# EAGLE schematic Schematic (EAGLE 9.5.1)
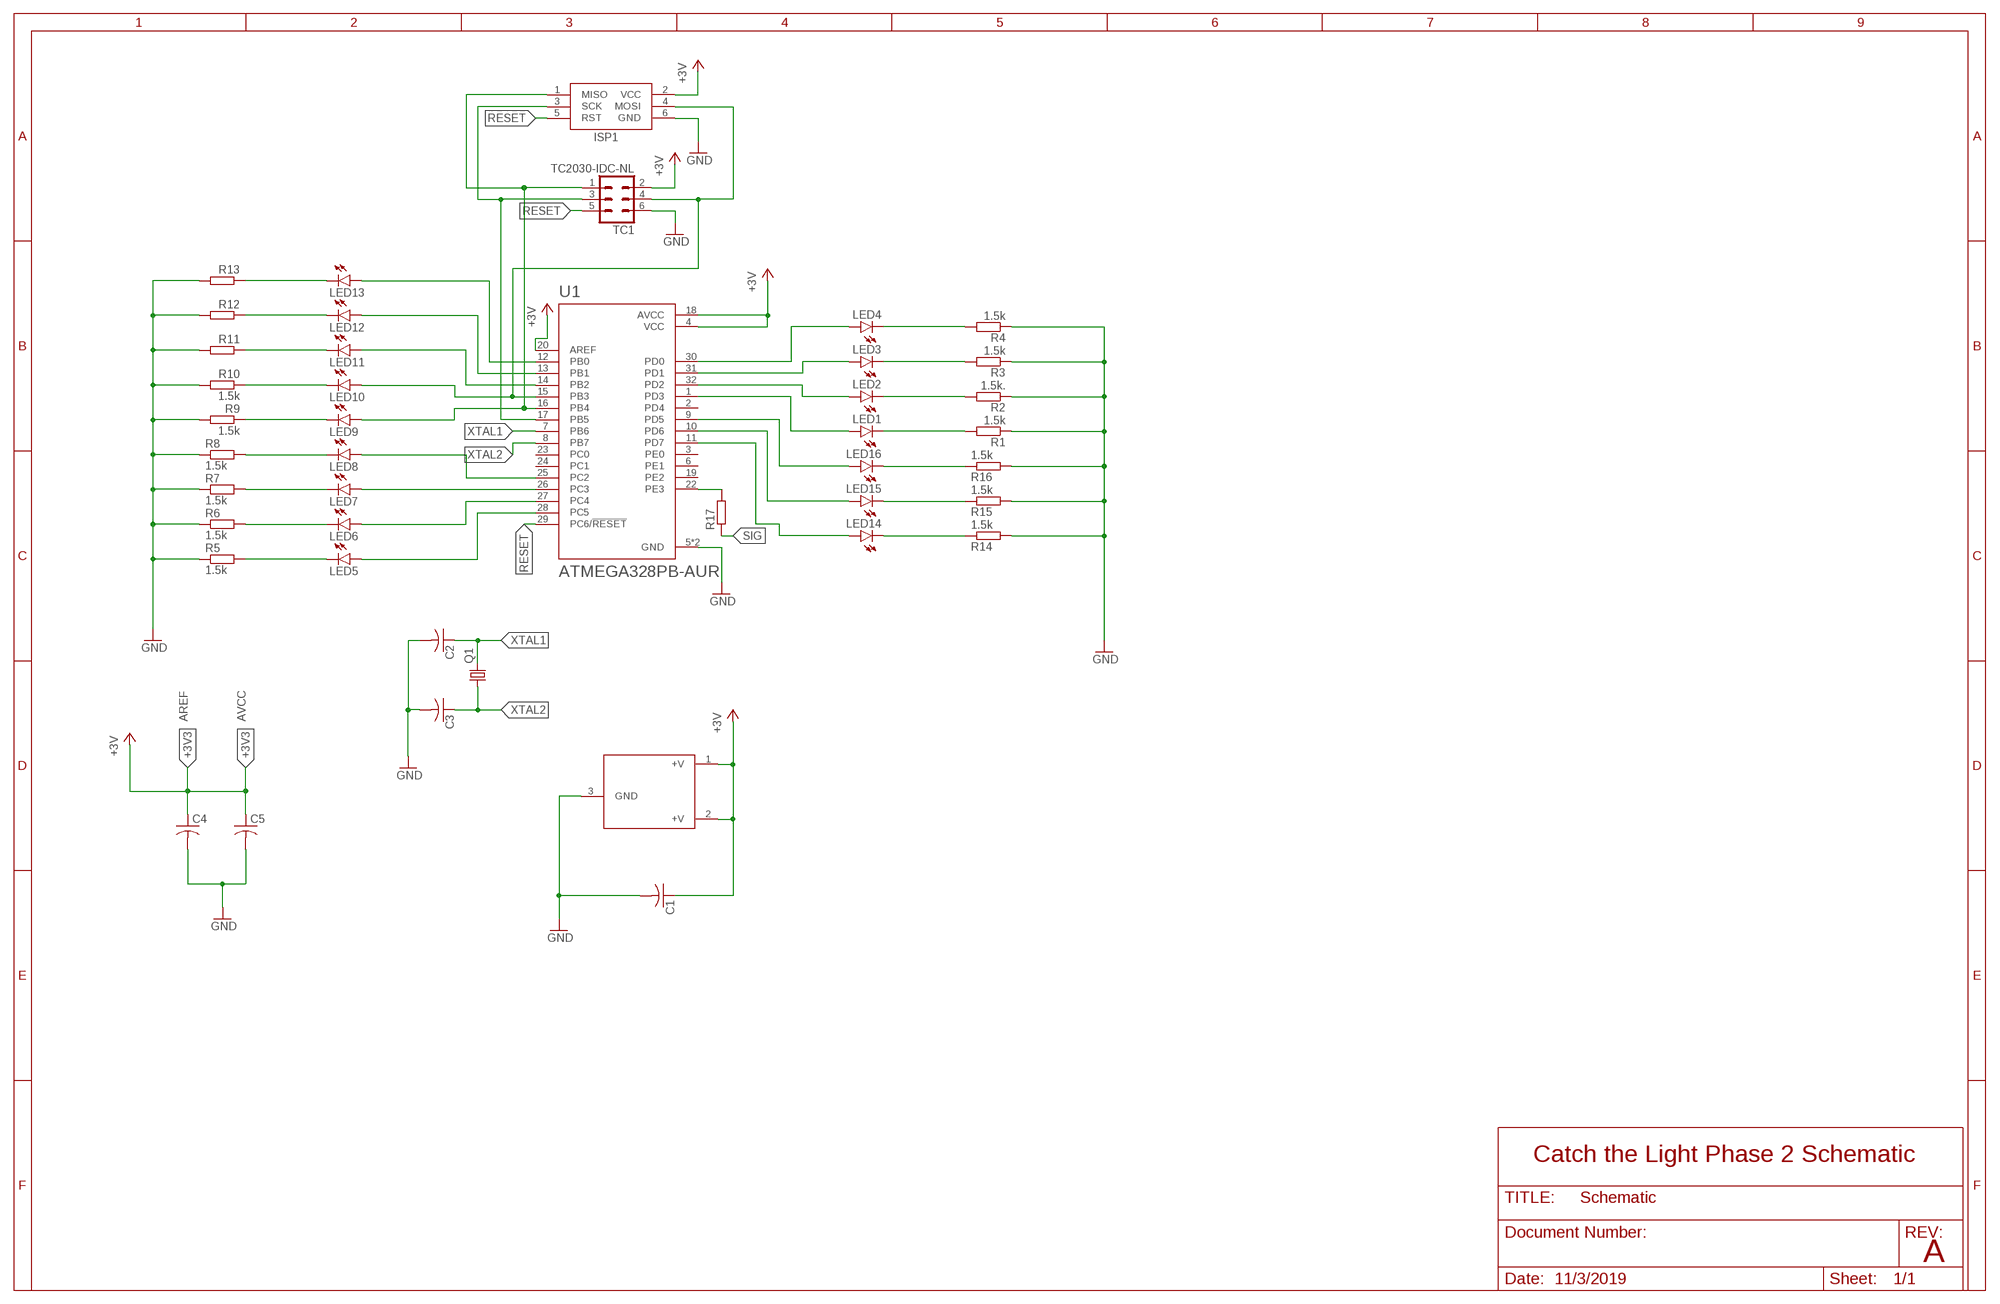
[diagram p0: schematic, sheet 1]

## Parts
BATT  BC-2003SMD  [BC-2003]
C1  C-USC0805  [C0805]
C2  C-USC0805  [C0805]
C3  C-USC0805  [C0805]
C4  C-USC0805  [C0805]
C5  C-USC0805  [C0805]
ISP1  AVRISP-6  [AVRISP]
LED1  LEDCHIP-LED0805  [CHIP-LED0805]
LED2  LEDCHIP-LED0805  [CHIP-LED0805]
LED3  LEDCHIP-LED0805  [CHIP-LED0805]
LED4  LEDCHIP-LED0805  [CHIP-LED0805]
LED5  LEDCHIP-LED0805  [CHIP-LED0805]
LED6  LEDCHIP-LED0805  [CHIP-LED0805]
LED7  LEDCHIP-LED0805  [CHIP-LED0805]
LED8  LEDCHIP-LED0805  [CHIP-LED0805]
LED9  LEDCHIP-LED0805  [CHIP-LED0805]
LED10  LEDCHIP-LED0805  [CHIP-LED0805]
LED11  LEDCHIP-LED0805  [CHIP-LED0805]
LED12  LEDCHIP-LED0805  [CHIP-LED0805]
LED13  LEDCHIP-LED0805  [CHIP-LED0805]
LED14  LEDCHIP-LED0805  [CHIP-LED0805]
LED15  LEDCHIP-LED0805  [CHIP-LED0805]
LED16  LEDCHIP-LED0805  [CHIP-LED0805]
Q1  CRYSTALHC49UP  [HC49UP]
R1  1.5k  R-EU_R0805  [R0805]
R2  1.5k.  R-EU_R0805  [R0805]
R3  1.5k  R-EU_R0805  [R0805]
R4  1.5k  R-EU_R0805  [R0805]
R5  1.5k  R-EU_R0805  [R0805]
R6  1.5k  R-EU_R0805  [R0805]
R7  1.5k  R-EU_R0805  [R0805]
R8  1.5k  R-EU_R0805  [R0805]
R9  1.5k  R-EU_R0805  [R0805]
R10  1.5k  R-EU_R0805  [R0805]
R11  R-EU_R0805  [R0805]
R12  R-EU_R0805  [R0805]
R13  R-EU_R0805  [R0805]
R14  1.5k  R-EU_R0805  [R0805]
R15  1.5k  R-EU_R0805  [R0805]
R16  1.5k  R-EU_R0805  [R0805]
R17  R-EU_R0805  [R0805]
TC1  TC2030-IDC-NL  [TC2030-IDC-NL]
U1  ATMEGA328PB-AUR  [QFP80P900X900X120-32N]

## Nets
+3V3: BATT.1(+V) BATT.2(+V) C1.1 C4.1 C5.1 ISP1.2(VCC) TC1.2 U1.4(VCC) U1.18(AVCC) U1.20(AREF) ; supply symbol labelled +3V
GND: BATT.3(GND) C1.2 C2.2 C3.2 C4.2 C5.2 ISP1.6(GND) R1.1 R2.1 R3.1 R4.1 R5.1 R6.1 R7.1 R8.1 R9.2 R10.2 R11.2 R12.2 R13.2 R14.2 R15.2 R16.2 TC1.6 U1.5(GND) U1.21(GND)
N$1: LED5.C R5.2
N$2: LED13.A U1.12(PB0)
N$3: LED12.A U1.13(PB1)
N$4: LED11.A U1.14(PB2)
N$5: LED6.A U1.27(PC4)
N$6: LED5.A U1.28(PC5)
N$7: LED8.A U1.25(PC2)
N$8: LED7.A U1.26(PC3)
N$9: LED4.A U1.30(PD0)
N$10: LED3.A U1.31(PD1)
N$11: LED2.A U1.32(PD2)
N$12: LED1.A U1.1(PD3)
N$13: LED16.A U1.9(PD5)
N$14: LED15.A U1.10(PD6)
N$15: LED14.A U1.11(PD7)
N$17: ISP1.3(SCK) TC1.3 U1.17(PB5)
N$32: LED9.C R9.1
N$33: R17.2 U1.22(PE3)
N$34: LED8.C R8.2
N$35: LED7.C R7.2
N$36: LED6.C R6.2
N$38: LED4.C R4.2
N$39: LED3.C R3.2
N$40: LED2.C R2.2
N$41: LED1.C R1.2
N$42: LED10.C R10.1
N$43: LED11.C R11.1
N$44: LED12.C R12.1
N$45: LED13.C R13.1
N$46: LED14.C R14.1
N$47: LED15.C R15.1
N$48: LED16.C R16.1
PB3: ISP1.4(MOSI) LED10.A TC1.4 U1.15(PB3)
PB4: ISP1.1(MISO) LED9.A TC1.1 U1.16(PB4)
RESET: ISP1.5(RST) TC1.5 U1.29(PC6/!RESET)
SIG: R17.1
XTAL1: C2.1 Q1.2 U1.7(PB6)
XTAL2: C3.1 Q1.1 U1.8(PB7)
Unconnected: U1.2(PD4) U1.3(PE0) U1.6(PE1) U1.19(PE2) U1.23(PC0) U1.24(PC1)

## Notes on the sheet
- AREF | AVCC
- Catch the Light Phase 2 Schematic
- A
- 11/3/2019

## Library data of the parts
BATT = My-library_:BC-2003: Batter Holder for the following: BR2032, CR2032, DL2032, LIR2032, BR2025, CR2025, DL2025, LIR2025
C1-C5 = rcl:C-US: CAPACITOR, American symbol; SPICEPREFIX: C
ISP1 = adafruit:AVRISP: AVR ISP HEADER Standard 6 pin header for AVR programming
LED1-LED16 = led:LED: LED OSRAM: - CHIPLED LG R971, LG N971, LY N971, LG Q971, LY Q971, LO R971, LY R971 LH N974, LH R974 LS Q976, LO Q976, LY Q976 LO Q996 - Hyper CHIPLED LW Q18S LB Q993, LB Q99A, LB R99A - SideLED LS A670, LO A670, LY A670, LG A670, LP A670 LB A673, LV A673, LT A673, LW A673 LH A674 LY A675 LS A676, LA A676, LO A676, LY A676, LW A676 LS A679, LY A679, LG A679 - Hyper Micro SIDELED® LS Y876, LA Y876, LO Y876, LY Y876 LT Y87S - SmartLED LW L88C, LW L88S LB L89C, LB L89S, LG L890 LS L89K, LO L89K, LY L89K LS L896, LA L896, LO L896, LY L896 - TOPLED LS T670, LO T670, LY T670, LG T670, LP T670 LSG T670, LSP T670, LSY T670, LOP T670, LYG T670 LG T671, LOG T671, LSG T671 LB T673, LV T673, LT T673, LW T673 LH T674 LS T676, LA T676, LO T676, LY T676, LB T676, LH T676, LSB T676, LW T676 LB T67C, LV T67C, LT T67C, LS T67K, LO T67K, LY T67K, LW E67C LS E67B, LA E67B, LO E67B, LY E67B, LB E67C, LV E67C, LT E67C LW T67C LS T679, LY T679, LG T679 LS T770, LO T770, LY T770, LG T770, LP T770 LB T773, LV T773, LT T773, LW T773 LH T774 LS E675, LA E675, LY E675, LS T675 LS T776, LA T776, LO T776, LY T776, LB T776 LHGB T686 LT T68C, LB T68C - Hyper Mini TOPLED® LB M676 - Mini TOPLED Santana® LG M470 LS M47K, LO M47K, LY M47K Source: http://www.osram.convergy.de LUXEON: - LUMILED® LXK2-PW12-R00, LXK2-PW12-S00, LXK2-PW14-U00, LXK2-PW14-V00 LXK2-PM12-R00, LXK2-PM12-S00, LXK2-PM14-U00 LXK2-PE12-Q00, LXK2-PE12-R00, LXK2-PE12-S00, LXK2-PE14-T00, LXK2-PE14-U00 LXK2-PB12-K00, LXK2-PB12-L00, LXK2-PB12-M00, LXK2-PB14-N00, LXK2-PB14-P00, LXK2-PB14-Q00 LXK2-PR12-L00, LXK2-PR12-M00, LXK2-PR14-Q00, LXK2-PR14-R00 LXK2-PD12-Q00, LXK2-PD12-R00, LXK2-PD12-S00 LXK2-PH12-R00, LXK2-PH12-S00 LXK2-PL12-P00, LXK2-PL12-Q00, LXK2-PL12-R00 Source: www.luxeon.com KINGBRIGHT: KA-3528ASYC Source: www.kingbright.com
Q1 = crystal:CRYSTAL: CRYSTAL; OC_FARNELL: unknown; OC_NEWARK: unknown
R1-R17 = rcl:R-EU_: RESISTOR, European symbol; SPICEPREFIX: R
TC1 = TagConnect:TC2030-IDC: Tag-Connect In Circuit Programming & Debug Cable 6 Pin http://www.tag-connect.com
U1 = ATMEGA328PB-AUR:ATMEGA328PB-AUR: ATmega Series 20 MHz 32 KB Flash 2 KB SRAM 8-Bit Microcontroller - TQFP-32; DESCRIPTION: AVR microcontroller; EEPROM: 1024B; SRAM: 2kB; Flash: 32kB; TQFP32; DIGI-KEY_PART_NUMBER: ATMEGA328PB-AURCT-ND; DIGI-KEY_PURCHASE_URL: https://www.digikey.com/product-detail/en/microchip-technology/ATMEGA328PB-AUR/ATMEGA328PB-AURCT-ND/5722706?utm_source=snapeda&utm_medium=aggregator&utm_campaign=symbol; MF: Microchip; MP: ATMEGA328PB-AUR; PACKAGE: TQFP-32 Microchip

## Net classes
0 default: clearance 0.205 mm